# EAGLE schematic pidControllerRev8 (EAGLE 9.6.2)
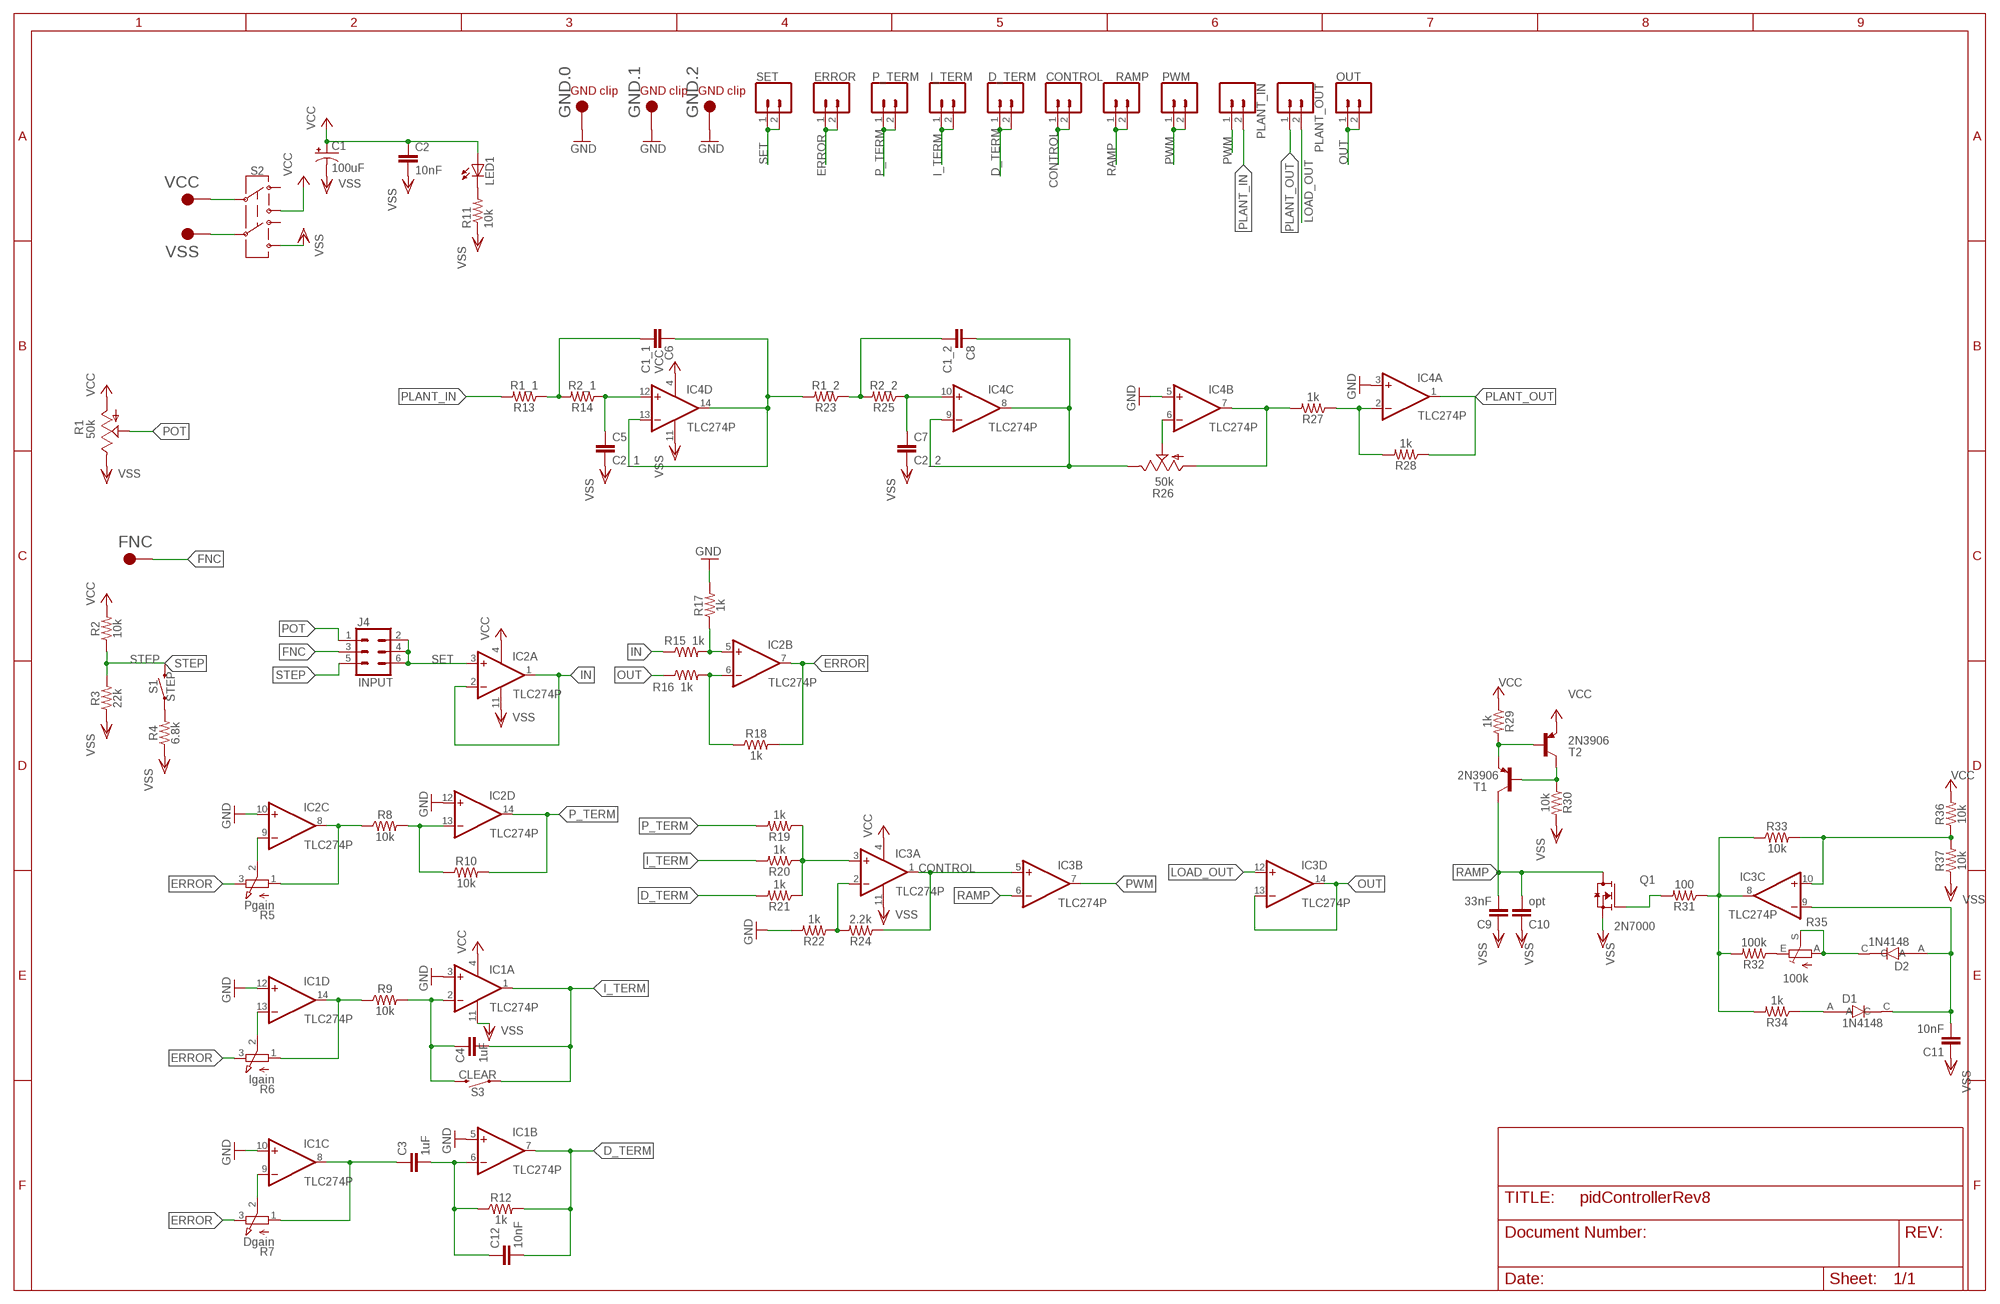
[diagram p0: schematic, sheet 1]

## Parts
C1  100uF  CPOL-USSANYO_C  [SANYO-OSCON_C]
C2  10nF  C-EUC1206  [C1206]
C3  1uF  C-EUC1206  [C1206]
C4  1uF  C-EUC1206  [C1206]
C5  C2_1  C-EUC1206  [C1206]
C6  C1_1  C-EUC1206  [C1206]
C7  C2_2  C-EUC1206  [C1206]
C8  C1_2  C-EUC1206  [C1206]
C9  33nF  C-EUC1206  [C1206]
C10  opt  C-EU050-024X044  [C050-024X044]
C11  10nF  C-EUC1206  [C1206]
C12  10nF  C-EUC1206  [C1206]
CONTROL  CONN_02LOCK  [1X02_LOCK]
D1  1N4148  1N4148WS-7-F  [SOD2513X120N]
D2  1N4148  1N4148WS-7-F  [SOD2513X120N]
D_TERM  CONN_02LOCK  [1X02_LOCK]
ERROR  CONN_02LOCK  [1X02_LOCK]
FNC  5016  [KEYSTONE_5016]
GND.0  5016  [KEYSTONE_5016]
GND.1  5016  [KEYSTONE_5016]
GND.2  5016  [KEYSTONE_5016]
I_TERM  CONN_02LOCK  [1X02_LOCK]
IC1  TLC274P  [DIL14]
IC2  TLC274P  [DIL14]
IC3  TLC274P  [DIL14]
IC4  TLC274P  [DIL14]
J4  INPUT  CONN_03X2FEMALE  [2X3]
LED1  LEDCHIPLED_1206  [CHIPLED_1206]
OUT  CONN_02LOCK  [1X02_LOCK]
P_TERM  CONN_02LOCK  [1X02_LOCK]
PLANT_IN  CONN_02LOCK  [1X02_LOCK]
PLANT_OUT  CONN_02LOCK  [1X02_LOCK]
PWM  CONN_02LOCK  [1X02_LOCK]
Q1  2N7000  [TO92254P458H750-3]
R1  50k  TRIM_US-B25P  [B25P]
R2  10k  RESISTOR1206  [1206]
R3  22k  RESISTOR1206  [1206]
R4  6.8k  RESISTOR1206  [1206]
R5  Pgain  EVUF2A  [EVUF]
R6  Igain  EVUF2A  [EVUF]
R7  Dgain  EVUF2A  [EVUF]
R8  10k  RESISTOR1206  [1206]
R9  10k  RESISTOR1206  [1206]
R10  10k  RESISTOR1206  [1206]
R11  10k  R-US_R1206  [R1206]
R12  1k  RESISTOR1206  [1206]
R13  R1_1  RESISTOR1206  [1206]
R14  R2_1  RESISTOR1206  [1206]
R15  1k  RESISTOR1206  [1206]
R16  1k  RESISTOR1206  [1206]
R17  1k  RESISTOR1206  [1206]
R18  1k  RESISTOR1206  [1206]
R19  1k  RESISTOR1206  [1206]
R20  1k  RESISTOR1206  [1206]
R21  1k  RESISTOR1206  [1206]
R22  1k  RESISTOR1206  [1206]
R23  R1_2  RESISTOR1206  [1206]
R24  2.2k  RESISTOR1206  [1206]
R25  R2_2  RESISTOR1206  [1206]
R26  50k  TRIM_US-B25P  [B25P]
R27  1k  RESISTOR1206  [1206]
R28  1k  RESISTOR1206  [1206]
R29  1k  RESISTOR1206  [1206]
R30  10k  RESISTOR1206  [1206]
R31  100  RESISTOR1206  [1206]
R32  100k  RESISTOR1206  [1206]
R33  10k  RESISTOR1206  [1206]
R34  1k  RESISTOR1206  [1206]
R35  100k  TRIM_EU-S64W  [S64W]
R36  10k  RESISTOR1206  [1206]
R37  10k  RESISTOR1206  [1206]
RAMP  CONN_02LOCK  [1X02_LOCK]
S1  STEP  MOMENTARY-SWITCH-SPST-SMD-5.2MM  [TACTILE_SWITCH_SMD_5.2MM]
S2  SWITCH-DPDT-SMD-AYZ0202  [SWITCH_DPDT_SMD_AYZ0202]
S3  CLEAR  MOMENTARY-SWITCH-SPST-SMD-5.2MM  [TACTILE_SWITCH_SMD_5.2MM]
SET  CONN_02LOCK  [1X02_LOCK]
T1  2N3906  2N3906-PNP-TO92-EBC  [TO92-EBC]
T2  2N3906  2N3906-PNP-TO92-EBC  [TO92-EBC]
VCC  5016  [KEYSTONE_5016]
VSS  5016  [KEYSTONE_5016]

## Nets
CONTROL: CONTROL.1 CONTROL.2 IC3.1(A:OUT) IC3.5(B:+IN) R24.1
D_TERM: C12.2 D_TERM.1 D_TERM.2 IC1.7(B:OUT) R12.2 R21.2
ERROR: ERROR.1 ERROR.2 IC2.7(B:OUT) R5.3(E) R6.3(E) R7.3(E) R18.2
FNC: FNC.TP J4.3
GND: GND.0.TP GND.1.TP GND.2.TP IC1.3(A:+IN) IC1.5(B:+IN) IC1.10(C:+IN) IC1.12(D:+IN) IC2.10(C:+IN) IC2.12(D:+IN) IC4.3(A:+IN) IC4.5(B:+IN) R17.2 R22.2
I_TERM: C4.2 I_TERM.1 I_TERM.2 IC1.1(A:OUT) R20.2 S3.1
IN: IC2.1(A:OUT) IC2.2(A:-IN) R15.1
LOAD_OUT: IC3.12(D:+IN) PLANT_OUT.2
N$1: IC2.5(B:+IN) R15.2 R17.1
N$2: IC2.6(B:-IN) R16.2 R18.1
N$3: IC4.7(B:OUT) R26.A R27.2
N$4: C4.1 IC1.2(A:-IN) R9.2 S3.3
N$5: IC2.8(C:OUT) R5.1(A) R8.1
N$6: IC3.3(A:+IN) R19.1 R20.1 R21.1
N$7: IC3.2(A:-IN) R22.1 R24.2
N$8: S2.5 VSS.TP
N$9: IC3.10(C:+IN) R33.2 R36.1 R37.2
N$10: IC4.2(A:-IN) R27.1 R28.2
N$11: IC3.8(C:OUT) R31.1 R32.2 R33.1 R34.2
N$12: R29.2 T1.E T2.B
N$13: R30.1 T1.B T2.C
N$14: IC1.14(D:OUT) R6.1(A) R9.1
N$15: S2.2 VCC.TP
N$16: LED1.C R11.2
N$17: C3.1 IC1.8(C:OUT) R7.1(A)
N$18: IC1.13(D:-IN) R6.2(S)
N$19: IC2.13(D:-IN) R8.2 R10.1
N$20: R32.1 R35.E
N$21: IC1.9(C:-IN) R7.2(S)
N$22: C3.2 C12.1 IC1.6(B:-IN) R12.1
N$23: IC2.9(C:-IN) R5.2(S)
N$24: R4.2 S1.1
N$25: C6.2 R13.1 R14.2
N$26: C5.1 IC4.12(D:+IN) R14.1
N$27: C6.1 IC4.13(D:-IN) IC4.14(D:OUT) R23.2
N$28: D1.A R34.1
N$29: C8.2 R23.1 R25.2
N$30: C7.1 IC4.10(C:+IN) R25.1
N$31: C8.1 IC4.8(C:OUT) IC4.9(C:-IN) R26.E
N$32: C11.2 D1.C D2.A IC3.9(C:-IN)
N$33: IC4.6(B:-IN) R26.S
N$34: Q1.2(G) R31.2
N$35: D2.C R35.A R35.S
OUT: IC3.13(D:-IN) IC3.14(D:OUT) OUT.1 OUT.2 R16.1
P_TERM: IC2.14(D:OUT) P_TERM.1 P_TERM.2 R10.2 R19.2
PLANT_IN: PLANT_IN.2 R13.2
PLANT_OUT: IC4.1(A:OUT) PLANT_OUT.1 R28.1
POT: J4.1 R1.S
PWM: IC3.7(B:OUT) PLANT_IN.1 PWM.1 PWM.2
RAMP: C9.2 C10.2 IC3.6(B:-IN) Q1.3(D) RAMP.1 RAMP.2 T1.C
SET: IC2.3(A:+IN) J4.2 J4.4 J4.6 SET.1 SET.2
STEP: J4.5 R2.1 R3.2 S1.3
VCC: C1.+ C2.1 IC1.4(P:V+) IC2.4(P:V+) IC3.4(P:V+) IC4.4(P:V+) LED1.A R1.A R2.2 R29.1 R36.2 S2.3 T2.E
VSS: C1.- C2.2 C5.2 C7.2 C9.1 C10.1 C11.1 IC1.11(P:V-) IC2.11(P:V-) IC3.11(P:V-) IC4.11(P:V-) Q1.1(S) R1.E R3.1 R4.1 R11.1 R30.2 R37.1 S2.6
Unconnected: S2.1 S2.4

## Notes on the sheet
- GND clip | GND clip | GND clip

## Library data of the parts
C1 = rcl:CPOL-US: POLARIZED CAPACITOR, American symbol; SPICEPREFIX: C
C2-C12 = rcl:C-EU: CAPACITOR, European symbol; SPICEPREFIX: C
CONTROL D_TERM ERROR I_TERM OUT P_TERM PLANT_IN PLANT_OUT PWM RAMP SET = SparkFun-Connectors:CONN_02: Multi connection point. Often used as Generic Header-pin footprint for 0.1 inch spaced/style header connections On any of the 0.1 inch spaced packages, you can populate with these: Break Away Headers - Straight <https://www.sparkfun.com/products/116> (PRT-00116) Break Away Male Headers - Right Angle <https://www.sparkfun.com/products/553> (PRT-00553) Female Headers <https://www.sparkfun.com/products/115> (PRT-00115) Break Away Headers - Machine Pin <https://www.sparkfun.com/products/117> (PRT-00117) Break Away Female Headers - Swiss Machine Pin <https://www.sparkfun.com/products/743> (PRT-00743) For SCREWTERMINALS and SPRING TERMINALS visit here: Screw Terimnals on SparkFun.com <https://www.sparkfun.com/search/results?term=Screw+Terminals> (5mm/3.5mm/2.54mm spacing) This device is also useful as a general connection point to wire up your design to another part of your project. Our various solder wires solder well into these plated through hole pads. Hook-Up Wire - Assortment (Stranded, 22 AWG) <https://www.sparkfun.com/products/11375> (PRT-11375) Hook-Up Wire - Assortment (Solid Core, 22 AWG) <https://www.sparkfun.com/products/11367> (PRT-11367) View the entire wire category on our website here <https://www.sparkfun.com/categories/141> Special notes: Molex polarized connector foot print use with: PRT-08233 with associated crimp pins and housings. 2.54_SCREWTERM for use with PRT-10571. 3.5mm Screw Terminal footprints for PRT-08084 5mm Screw Terminal footprints for use with PRT-08432
D1 D2 = 1N4148WS-7-F:1N4148WS-7-F; MANUFACTURER: Diodes Inc.
FNC GND.0 GND.1 GND.2 VCC VSS = 5016:5016; MANUFACTURER: Keystone Electronics; MAXIMUM_PACKAGE_HEIGHT: 2.29 mm; PARTREV: D; SNAPEDA_PN: 5016; STANDARD: Manufacturer Recommendations
IC1-IC4 = linear:TLC274: OP AMP
J4 = SparkFun-Connectors:CONN_03X2: Multi connection point. Often used as Generic Header-pin footprint for 0.1 inch spaced/style header connections You can populate with any combo of single row headers, but if you'd like an exact match, check these: Header - 2x3 (Male, 0.1") <https://www.sparkfun.com/products/12807> (PRT-12807) Header - 2x3 (Female, 0.1") <https://www.sparkfun.com/products/13010> (PRT-13010) 2x3 Pin Shrouded Header <https://www.sparkfun.com/products/10877> (PRT-10877) On any of the 0.1 inch spaced packages, you can populate with these: Break Away Headers - Straight <https://www.sparkfun.com/products/116> (PRT-00116) Break Away Male Headers - Right Angle <https://www.sparkfun.com/products/553> (PRT-00553) Female Headers <https://www.sparkfun.com/products/115> (PRT-00115) Break Away Headers - Machine Pin <https://www.sparkfun.com/products/117> (PRT-00117) Break Away Female Headers - Swiss Machine Pin <https://www.sparkfun.com/products/743> (PRT-00743) Special note: the shrouded connector mates well with our 3x2 ribbon cables: Ribbon Crimp Connector - 6-pin (2x3, Female) <https://www.sparkfun.com/products/10651> (PRT-10651) Ribbon Cable - 6 wire (15ft) <https://www.sparkfun.com/products/10646> (PRT-10646); PROD_ID: CONN-11566; VALUE: FEMALE 2x3
LED1 = led:LED: LED OSRAM: - CHIPLED LG R971, LG N971, LY N971, LG Q971, LY Q971, LO R971, LY R971 LH N974, LH R974 LS Q976, LO Q976, LY Q976 LO Q996 - Hyper CHIPLED LW Q18S LB Q993, LB Q99A, LB R99A - SideLED LS A670, LO A670, LY A670, LG A670, LP A670 LB A673, LV A673, LT A673, LW A673 LH A674 LY A675 LS A676, LA A676, LO A676, LY A676, LW A676 LS A679, LY A679, LG A679 - Hyper Micro SIDELED® LS Y876, LA Y876, LO Y876, LY Y876 LT Y87S - SmartLED LW L88C, LW L88S LB L89C, LB L89S, LG L890 LS L89K, LO L89K, LY L89K LS L896, LA L896, LO L896, LY L896 - TOPLED LS T670, LO T670, LY T670, LG T670, LP T670 LSG T670, LSP T670, LSY T670, LOP T670, LYG T670 LG T671, LOG T671, LSG T671 LB T673, LV T673, LT T673, LW T673 LH T674 LS T676, LA T676, LO T676, LY T676, LB T676, LH T676, LSB T676, LW T676 LB T67C, LV T67C, LT T67C, LS T67K, LO T67K, LY T67K, LW E67C LS E67B, LA E67B, LO E67B, LY E67B, LB E67C, LV E67C, LT E67C LW T67C LS T679, LY T679, LG T679 LS T770, LO T770, LY T770, LG T770, LP T770 LB T773, LV T773, LT T773, LW T773 LH T774 LS E675, LA E675, LY E675, LS T675 LS T776, LA T776, LO T776, LY T776, LB T776 LHGB T686 LT T68C, LB T68C - Hyper Mini TOPLED® LB M676 - Mini TOPLED Santana® LG M470 LS M47K, LO M47K, LY M47K Source: http://www.osram.convergy.de LUXEON: - LUMILED® LXK2-PW12-R00, LXK2-PW12-S00, LXK2-PW14-U00, LXK2-PW14-V00 LXK2-PM12-R00, LXK2-PM12-S00, LXK2-PM14-U00 LXK2-PE12-Q00, LXK2-PE12-R00, LXK2-PE12-S00, LXK2-PE14-T00, LXK2-PE14-U00 LXK2-PB12-K00, LXK2-PB12-L00, LXK2-PB12-M00, LXK2-PB14-N00, LXK2-PB14-P00, LXK2-PB14-Q00 LXK2-PR12-L00, LXK2-PR12-M00, LXK2-PR14-Q00, LXK2-PR14-R00 LXK2-PD12-Q00, LXK2-PD12-R00, LXK2-PD12-S00 LXK2-PH12-R00, LXK2-PH12-S00 LXK2-PL12-P00, LXK2-PL12-Q00, LXK2-PL12-R00 Source: www.luxeon.com KINGBRIGHT: KA-3528ASYC Source: www.kingbright.com
Q1 = 2N7000:2N7000; MANUFACTURER: Diotec Semiconductor; MAXIMUM_PACKAGE_HEIGHT: 7.5mm; PARTREV: 2024-07-16; STANDARD: IPC 7351B
R1 R26 = pot:TRIM_US-: POTENTIOMETER
R2-R4 R8-R10 R12-R25 R27-R34 R36 R37 = SparkFun-Resistors:RESISTOR: Generic Resistor Package
R5-R7 = pot:EVU: 9 mm Square Rotary Potentiometers Source: Panasonic
R11 = rcl:R-US_: RESISTOR, American symbol; SPICEPREFIX: R
R35 = pot:TRIM_EU-: POTENTIOMETER
S1 S3 = SparkFun-Switches:MOMENTARY-SWITCH-SPST: Momentary Switch (Pushbutton) - SPST Normally-open (NO) SPST momentary switches (buttons, pushbuttons). Variants PTH-12MM - 12mm square, through-hole Momentary Pushbutton Switch - 12mm Square <https://www.sparkfun.com/products/9190> (COM-09190) PTH-6.0MM, PTH-6.0MM-KIT - 6.0mm square, through-hole Mini Pushbutton Switch <https://www.sparkfun.com/products/97> (COM-00097) KIT package intended for soldering kit's - only one side of pads' copper is exposed. PTH-RIGHT-ANGLE-KIT - Right-angle, through-hole Right Angle Tactile Button <https://www.sparkfun.com/products/10791> - Used on SparkFun BigTime Watch Kit <https://www.sparkfun.com/products/11734> SMD-12MM - 12mm square, surface-mount Tactile Button - SMD (12mm) <https://www.sparkfun.com/products/12993> (COM-12993) Used on SparkFun PicoBoard <https://www.sparkfun.com/products/11888> SMD-4.5MM - 4.5mm Square Trackball Switch Used on SparkFun Blackberry Trackballer Breakout <https://www.sparkfun.com/products/13169> SMD-4.6MMX2.8MM - 4.60mm x 2.80mm, surface mount Used on SparkFun SAMD21 Mini Breakout <https://www.sparkfun.com/products/13664> SMD-5.2MM, SMD-5.2-REDUNDANT - 5.2mm square, surface-mount Mini Pushbutton Switch - SMD <https://www.sparkfun.com/products/8720> (COM-08720) Used on Arduino Pro Mini <https://www.sparkfun.com/products/11114> REDUNDANT package connects both switch circuits together SMD-6.0X3.5MM - 6.0 x 3.5mm, surface mount Momentary Reset Switch SMD <https://www.sparkfun.com/products/8229> (COM-08229) SMD-6.2MM-TALL - 6.2mm square, surface mount Tactile Button - SMD (6mm) <https://www.sparkfun.com/products/12992> Used on SparkFun Digital Sandbox <https://www.sparkfun.com/products/12651> SMD-RIGHT-ANGLE - Right-angle, surface mount Used on SparkFun Block for Intel® Edison - Arduino <https://www.sparkfun.com/products/13036>; PROD_ID: SWCH-08247; SF_SKU: COM-08720
S2 = SparkFun-Switches:SWITCH-DPDT: Double-Pole, Double-Throw (DPDT) Switch Double-pole, double-throw switches. Variant Overview PTH-GPI-152-3013 Used on SparkFun Geiger Counter <https://www.sparkfun.com/products/11345> SMD-AY0202 Surface Mount DPDT Switch <https://www.sparkfun.com/products/597> (COM-00597) Used on e.g. LilyPad Arduino USB - ATmega32U4 Board <https://www.sparkfun.com/products/12049>; PROD_ID: SWCH-08179; SF_SKU: COM-00597
T1 T2 = transistor-neu-to92:*-PNP-: PNP Transistror